# Altium schematic sheet Ethernet_Unit.SchDoc
size C
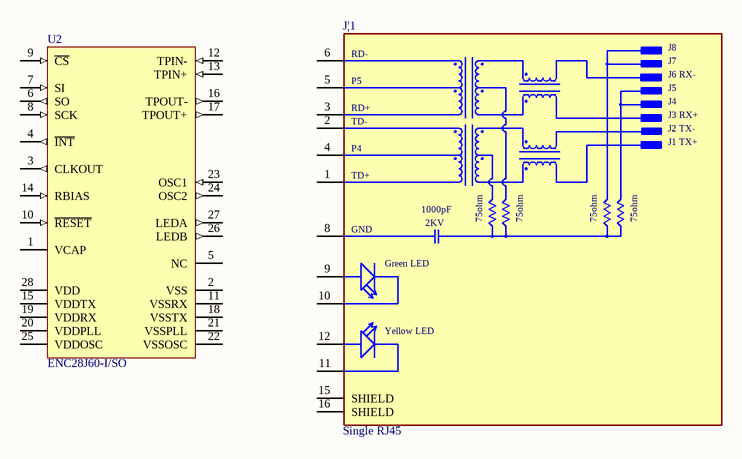
[diagram p0: Ethernet_Unit.SchDoc]

## Parts
J|1  Single RJ45  [HANRUN_HR911105A]
U2  ENC28J60-I/SO  [SOIC-SO28_N]

## Nets

Not connected (* = marked no-connect by the designer): J|1 1(TD+) 2(TD-) 3(RD+) 4(P4) 5(P5) 6(RD-) 8(GND) 9(GA) 10(GC) 11(YC) 12(YA) 15(SHIELD) 16(SHIELD); U2 1(VCAP) 2(VSS) 3(CLKOUT) 4(~{INT}) 5(NC) 6(SO) 7(SI) 8(SCK) 9(~{CS}) 10(~{RESET}) 11(VSSRX) 12(TPIN-) 13(TPIN+) 14(RBIAS) 15(VDDTX) 16(TPOUT-) 17(TPOUT+) 18(VSSTX) 19(VDDRX) 20(VDDPLL) 21(VSSPLL) 22(VSSOSC) 23(OSC1) 24(OSC2) 25(VDDOSC) 26(LEDB) 27(LEDA) 28(VDD)

## Notes on the sheet
- CONFIDENTAL. Do not distribute.
- Page Contents:
- Title:
- Company
- Logo
- Date:
- SIZE:
- C
- DWG Num:
- Time:
- Variant:
- Sheet
- Revision:
- of
- Drawn by:
- Checked by:
- (in symbol HR911105A) J8; J7; J6 RX-; J5; J4; J3 RX+; J2 TX-; J1 TX+; 1000pF; 75ohm; 2KV; Green LED; Yellow LED

## Library data of the parts
J|1 = HR911105A: HR911105A Ethernet Interface Arduino Platform Evaluation Expansion Board; MF: DFRobot; Package: None; Availability: Unavailable; MP: HR911105A; Value: *; SnapEDA_Link: https://www.snapeda.com/parts/HR911105A/DFRobot/view-part/214807/?ref=snap; Price: None
U2 = ENC28J60-I/SO: Stand-Alone Ethernet Controller with SPI Interface, 28-Pin SOIC, Industrial Temperature; ComponentLink1Description: Manufacturer URL; ComponentLink2Description: Datasheet; DatasheetVersion: revC, Jan-2008; ComponentLink3URL: http://www.microchip.com/stellent/groups/techpub_sg/documents/packagingspec/en012702.pdf; ComponentLink3Description: Package Specification; ComponentLink1URL: http://www.microchip.com/; Code_JEDEC: MS-013; RevisionNote: URLs added.; PackageVersion: revBB, Aug-2009; PackageDescription: 28-Lead Plastic Small Outline (SO) - Wide 7.50mm Body [SOIC]; ComponentLink2URL: http://ww1.microchip.com/downloads/en/DeviceDoc/39662c.pdf; PackageReference: SOIC-SO28; PartNumber: ENC28J60-I/SO; Supplier 1: RSComponents; Supplier Part Number 1: 6988987